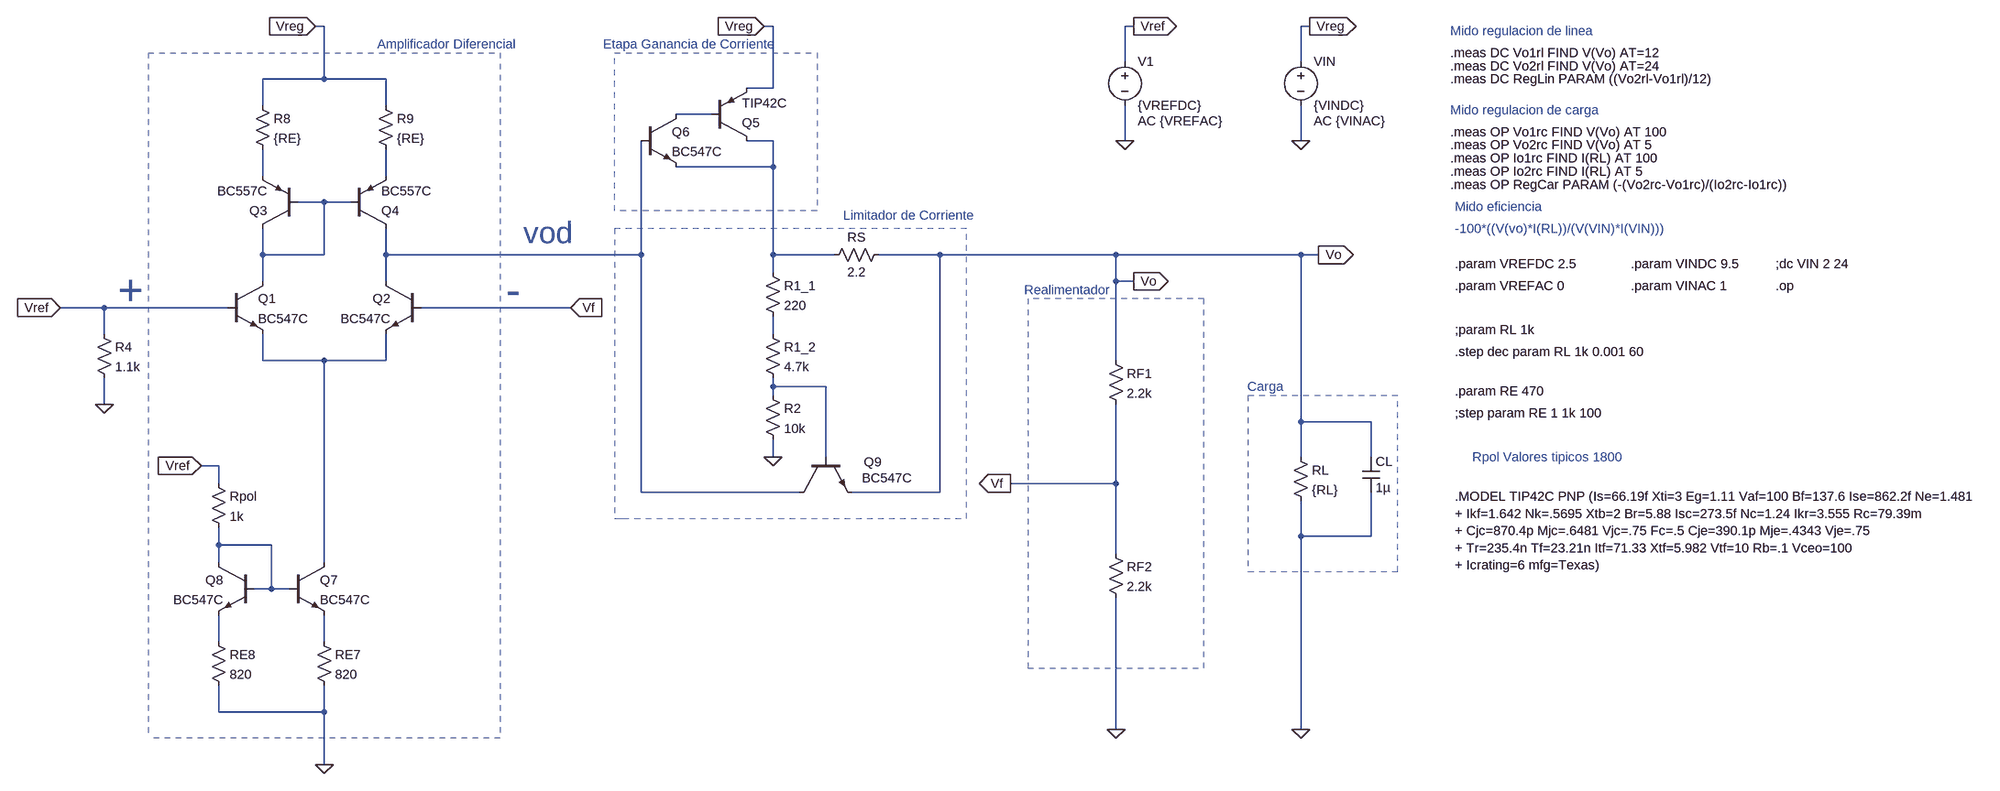
[diagram p0: schematic Regulacion de Carga.asc]
Regulacion de Carga.asc, the LTspice schematic file:
Version 4
SHEET 1 3312 1188
WIRE 208 -224 192 -224
WIRE 1024 -224 1008 -224
WIRE 1680 -224 1664 -224
WIRE 2000 -224 1984 -224
WIRE 1664 -160 1664 -224
WIRE 1984 -160 1984 -224
WIRE 208 -128 208 -224
WIRE 208 -128 96 -128
WIRE 320 -128 208 -128
WIRE 1024 -112 1024 -224
WIRE 1024 -112 976 -112
WIRE 96 -80 96 -128
WIRE 320 -80 320 -128
WIRE 912 -64 848 -64
WIRE 1024 -16 976 -16
WIRE 1664 -16 1664 -80
WIRE 1984 -16 1984 -80
WIRE 1024 32 1024 -16
WIRE 1024 32 848 32
WIRE 96 48 96 0
WIRE 320 48 320 0
WIRE 208 96 160 96
WIRE 256 96 208 96
WIRE 96 192 96 144
WIRE 208 192 208 96
WIRE 208 192 96 192
WIRE 320 192 320 144
WIRE 784 192 784 -16
WIRE 784 192 320 192
WIRE 1024 192 1024 32
WIRE 1136 192 1024 192
WIRE 1328 192 1216 192
WIRE 1648 192 1328 192
WIRE 1984 192 1648 192
WIRE 2016 192 1984 192
WIRE 1024 224 1024 192
WIRE 96 240 96 192
WIRE 320 240 320 192
WIRE 1648 240 1648 192
WIRE 1680 240 1648 240
WIRE -192 288 -272 288
WIRE 32 288 -192 288
WIRE 656 288 384 288
WIRE -192 336 -192 288
WIRE 1024 336 1024 304
WIRE 96 384 96 336
WIRE 208 384 96 384
WIRE 320 384 320 336
WIRE 320 384 208 384
WIRE 1648 384 1648 240
WIRE 1024 432 1024 416
WIRE 1120 432 1024 432
WIRE 1024 448 1024 432
WIRE -192 464 -192 416
WIRE 1984 496 1984 192
WIRE 2112 496 1984 496
WIRE 1024 560 1024 528
WIRE 1120 560 1120 432
WIRE 1984 560 1984 496
WIRE 2112 560 2112 496
WIRE 16 576 -16 576
WIRE 16 608 16 576
WIRE 1648 608 1648 464
WIRE 1648 608 1456 608
WIRE 784 624 784 192
WIRE 1072 624 784 624
WIRE 1328 624 1328 192
WIRE 1328 624 1168 624
WIRE 1984 704 1984 640
WIRE 2112 704 2112 624
WIRE 2112 704 1984 704
WIRE 16 720 16 688
WIRE 112 720 16 720
WIRE 1648 736 1648 608
WIRE 16 752 16 720
WIRE 208 752 208 384
WIRE 112 800 112 720
WIRE 112 800 80 800
WIRE 144 800 112 800
WIRE 16 896 16 848
WIRE 208 896 208 848
WIRE 16 1024 16 976
WIRE 208 1024 208 976
WIRE 208 1024 16 1024
WIRE 1648 1056 1648 816
WIRE 1984 1056 1984 704
WIRE 208 1120 208 1024
FLAG 2016 192 Vo
IOPIN 2016 192 Out
FLAG 1680 -224 Vref
IOPIN 1680 -224 Out
FLAG 1456 608 Vf
IOPIN 1456 608 Out
FLAG 1664 -16 0
FLAG 2000 -224 Vreg
IOPIN 2000 -224 Out
FLAG 1984 1056 0
FLAG 1648 1056 0
FLAG -272 288 Vref
IOPIN -272 288 In
FLAG -16 576 Vref
IOPIN -16 576 In
FLAG 1984 -16 0
FLAG 1008 -224 Vreg
IOPIN 1008 -224 In
FLAG 1024 560 0
FLAG -192 464 0
FLAG 656 288 Vf
IOPIN 656 288 In
FLAG 192 -224 Vreg
IOPIN 192 -224 In
FLAG 208 1120 0
FLAG 1680 240 Vo
IOPIN 1680 240 Out
DATAFLAG 16 288 ""
DATAFLAG 368 192 ""
DATAFLAG 112 192 ""
DATAFLAG 224 96 ""
DATAFLAG 320 32 ""
SYMBOL pnp 160 144 R180
SYMATTR InstName Q3
SYMATTR Value BC557C
SYMBOL pnp 256 144 M180
SYMATTR InstName Q4
SYMATTR Value BC557C
SYMBOL npn 32 240 R0
SYMATTR InstName Q1
SYMATTR Value BC547C
SYMBOL npn 384 240 M0
SYMATTR InstName Q2
SYMATTR Value BC547C
SYMBOL pnp 912 -16 M180
SYMATTR InstName Q5
SYMATTR Value TIP42C
SYMBOL npn 784 -64 R0
SYMATTR InstName Q6
SYMATTR Value BC547C
SYMBOL res 1632 368 R0
SYMATTR InstName RF1
SYMATTR Value 2.2k
SYMBOL res 1632 720 R0
SYMATTR InstName RF2
SYMATTR Value 2.2k
SYMBOL res 1968 544 R0
SYMATTR InstName RL
SYMATTR Value {RL}
SYMBOL voltage 1664 -176 R0
WINDOW 123 24 124 Left 2
WINDOW 39 0 0 Left 0
SYMATTR Value2 AC {VREFAC}
SYMATTR InstName V1
SYMATTR Value {VREFDC}
SYMBOL res 80 -96 R0
SYMATTR InstName R8
SYMATTR Value {RE}
SYMBOL res 304 -96 R0
SYMATTR InstName R9
SYMATTR Value {RE}
SYMBOL cap 2096 560 R0
SYMATTR InstName CL
SYMATTR Value 1µ
SYMBOL voltage 1984 -176 R0
WINDOW 123 24 124 Left 2
WINDOW 39 0 0 Left 0
SYMATTR Value2 AC {VINAC}
SYMATTR InstName VIN
SYMATTR Value {VINDC}
SYMBOL npn 144 752 R0
SYMATTR InstName Q7
SYMATTR Value BC547C
SYMBOL npn 80 752 M0
SYMATTR InstName Q8
SYMATTR Value BC547C
SYMBOL res 0 592 R0
SYMATTR InstName Rpol
SYMATTR Value 1k
SYMBOL npn 1072 560 M90
WINDOW 0 9 117 VRight 2
WINDOW 3 38 114 VRight 2
SYMATTR InstName Q9
SYMATTR Value BC547C
SYMBOL res 1232 176 R90
WINDOW 0 0 56 VBottom 2
WINDOW 3 32 56 VTop 2
SYMATTR InstName RS
SYMATTR Value 2.2
SYMBOL res 1008 432 R0
SYMATTR InstName R2
SYMATTR Value 10k
SYMBOL res 1008 208 R0
SYMATTR InstName R1_1
SYMATTR Value 220
SYMBOL res -208 320 R0
SYMATTR InstName R4
SYMATTR Value 1.1k
SYMBOL res 192 880 R0
SYMATTR InstName RE7
SYMATTR Value 820
SYMBOL res 0 880 R0
SYMATTR InstName RE8
SYMATTR Value 820
SYMBOL res 1008 320 R0
SYMATTR InstName R1_2
SYMATTR Value 4.7k
TEXT 2848 248 Left 2 !.op
TEXT 2584 208 Left 2 !.param VINDC 9.5
TEXT 2584 248 Left 2 !.param VINAC 1
TEXT 2264 208 Left 2 !.param VREFDC 2.5
TEXT 2264 248 Left 2 !.param VREFAC 0
TEXT 2264 328 Left 2 !;param RL 1k
TEXT 2848 208 Left 2 !;dc VIN 2 24
TEXT 2264 480 Left 2 !;step param RE 1 1k 100
TEXT 2264 440 Left 2 !.param RE 470
TEXT 2264 368 Left 2 !.step dec param RL 1k 0.001 60
TEXT 2256 -216 Left 2 ;Mido regulacion de linea
TEXT 2256 -176 Left 2 !.meas DC Vo1rl FIND V(Vo) AT=12
TEXT 2256 -152 Left 2 !.meas DC Vo2rl FIND V(Vo) AT=24
TEXT 2256 -128 Left 2 !.meas DC RegLin PARAM ((Vo2rl-Vo1rl)/12)
TEXT 2256 -72 Left 2 ;Mido regulacion de carga
TEXT 2256 -32 Left 2 !.meas OP Vo1rc FIND V(Vo) AT 100
TEXT 2256 -8 Left 2 !.meas OP Vo2rc FIND V(Vo) AT 5
TEXT 2256 16 Left 2 !.meas OP Io1rc FIND I(RL) AT 100
TEXT 2256 40 Left 2 !.meas OP Io2rc FIND I(RL) AT 5
TEXT 2264 104 Left 2 ;Mido eficiencia
TEXT 2264 144 Left 2 ;-100*((V(vo)*I(RL))/(V(VIN)*I(VIN)))
TEXT 2256 64 Left 2 !.meas OP RegCar PARAM (-(Vo2rc-Vo1rc)/(Io2rc-Io1rc))
TEXT 2296 560 Left 2 ;Rpol Valores tipicos 1800
TEXT 2264 632 Left 2 !.MODEL TIP42C PNP (Is=66.19f Xti=3 Eg=1.11 Vaf=100 Bf=137.6 Ise=862.2f Ne=1.481  \n+ Ikf=1.642 Nk=.5695 Xtb=2 Br=5.88 Isc=273.5f Nc=1.24 Ikr=3.555 Rc=79.39m  \n+ Cjc=870.4p Mjc=.6481 Vjc=.75 Fc=.5 Cje=390.1p Mje=.4343 Vje=.75  \n+ Tr=235.4n Tf=23.21n Itf=71.33 Xtf=5.982 Vtf=10 Rb=.1 Vceo=100  \n+ Icrating=6 mfg=Texas)
TEXT -144 256 Center 6 ;+
TEXT 552 256 Center 6 ;-
TEXT 616 152 Center 5 ;vod
TEXT 304 -192 Left 2 ;Amplificador Diferencial
TEXT 872 -192 Center 2 ;Etapa Ganancia de Corriente
TEXT 1272 120 Center 2 ;Limitador de Corriente
TEXT 1560 256 Center 2 ;Realimentador
TEXT 1920 432 Center 2 ;Carga
LINE Normal 528 1072 -112 1072 1
LINE Normal -112 -176 -112 1072 1
LINE Normal 528 -176 528 1072 1
LINE Normal -112 -176 528 -176 1
LINE Normal 1104 112 736 112 1
LINE Normal 1104 -176 1104 112 1
LINE Normal 736 -176 1104 -176 1
LINE Normal 736 112 736 -176 1
LINE Normal 1376 144 736 144 1
LINE Normal 1376 672 1376 144 1
LINE Normal 752 672 1376 672 1
LINE Normal 736 672 752 672 1
LINE Normal 736 144 736 672 1
LINE Normal 1488 272 1488 592 1
LINE Normal 1488 592 1488 944 1
LINE Normal 1808 272 1488 272 1
LINE Normal 1808 944 1808 272 1
LINE Normal 1488 944 1808 944 1
LINE Normal 2160 448 1888 448 1
LINE Normal 2160 768 2160 448 1
LINE Normal 1888 768 2160 768 1
LINE Normal 1888 448 1888 768 1

The netlist it stands for:
* Regulacion de Carga.asc
Q3 N005 N005 N003 0 BC557C
Q4 N006 N005 N004 0 BC557C
Q1 N005 Vref N008 0 BC547C
Q2 N006 Vf N008 0 BC547C
Q5 N002 N001 Vreg 0 TIP42C
Q6 N001 N006 N002 0 BC547C
RF1 Vo Vf 2.2k
RF2 Vf 0 2.2k
RL Vo 0 {RL}
V1 Vref 0 {VREFDC} AC {VREFAC}
R8 Vreg N003 {RE}
R9 Vreg N004 {RE}
CL Vo 0 1µ
VIN Vreg 0 {VINDC} AC {VINAC}
Q7 N008 N010 N012 0 BC547C
Q8 N010 N010 N011 0 BC547C
Rpol Vref N010 1k
Q9 N006 N009 Vo 0 BC547C
RS Vo N002 2.2
R2 N009 0 10k
R1_1 N002 N007 220
R4 Vref 0 1.1k
RE7 N012 0 820
RE8 N011 0 820
R1_2 N007 N009 4.7k
.model NPN NPN
.model PNP PNP
.lib standard.bjt
.op
.param VINDC 9.5
.param VINAC 1
.param VREFDC 2.5
.param VREFAC 0
;param RL 1k
;dc VIN 2 24
;step param RE 1 1k 100
.param RE 470
.step dec param RL 1k 0.001 60
* Mido regulacion de linea
.meas DC Vo1rl FIND V(Vo) AT=12
.meas DC Vo2rl FIND V(Vo) AT=24
.meas DC RegLin PARAM ((Vo2rl-Vo1rl)/12)
* Mido regulacion de carga
.meas OP Vo1rc FIND V(Vo) AT 100
.meas OP Vo2rc FIND V(Vo) AT 5
.meas OP Io1rc FIND I(RL) AT 100
.meas OP Io2rc FIND I(RL) AT 5
* Mido eficiencia
* -100*((V(vo)*I(RL))/(V(VIN)*I(VIN)))
.meas OP RegCar PARAM (-(Vo2rc-Vo1rc)/(Io2rc-Io1rc))
* Rpol Valores tipicos 1800
.MODEL TIP42C PNP (Is=66.19f Xti=3 Eg=1.11 Vaf=100 Bf=137.6 Ise=862.2f Ne=1.481
+ Ikf=1.642 Nk=.5695 Xtb=2 Br=5.88 Isc=273.5f Nc=1.24 Ikr=3.555 Rc=79.39m
+ Cjc=870.4p Mjc=.6481 Vjc=.75 Fc=.5 Cje=390.1p Mje=.4343 Vje=.75
+ Tr=235.4n Tf=23.21n Itf=71.33 Xtf=5.982 Vtf=10 Rb=.1 Vceo=100
+ Icrating=6 mfg=Texas)
* +
* -
* vod
* Amplificador Diferencial
* Etapa Ganancia de Corriente
* Limitador de Corriente
* Realimentador
* Carga
.backanno
.end

* Results of the author's LTspice run, read from the files saved beside the schematic
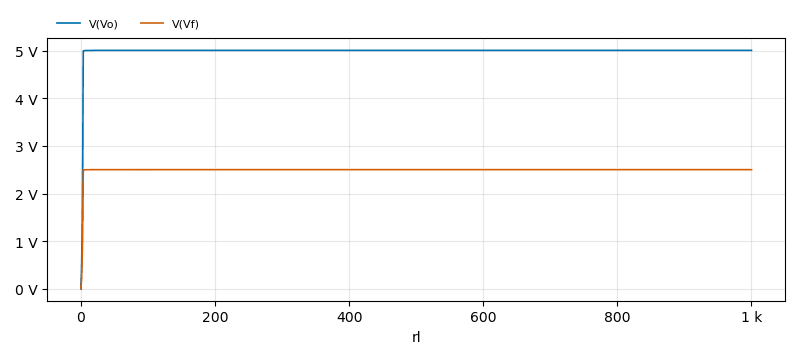
[diagram p1: Operating Point of Regulacion de Carga.asc, plotted from the saved traces]
* Operating Point, 1 run:
*   V(Vo): 428 µV at rl=1 m, 5.006 V at rl=1 k, min 428 µV, max 5.006 V
*   V(Vf): 214 µV at rl=1 m, 2.502 V at rl=1 k, min 214 µV, max 2.502 V
* From the log:
*   Semiconductor Device Operating Points:
*                           --- Bipolar Transistors ---
*   Name:       q5          q9          q8          q7          q6
*   Model:    tip42c      bc547c      bc547c      bc547c      bc547c
*   Ib:      -4.11e-03    2.23e-06    2.27e-06    2.26e-06    8.14e-06
*   Ic:      -4.23e-01    1.03e-03    1.03e-03    1.03e-03    4.11e-03
*   Vbe:     -7.68e-01    6.22e-01    6.23e-01    6.22e-01    6.57e-01
*   Vbc:      7.79e+00   -9.74e-01    0.00e+00   -4.13e-01   -7.14e+00
*   Vce:     -8.56e+00    1.60e+00    6.23e-01    1.04e+00    7.79e+00
*   BetaDC:   1.03e+02    4.61e+02    4.52e+02    4.56e+02    5.05e+02
*   Gm:       1.32e+01    3.90e-02    3.90e-02    3.91e-02    1.53e-01
*   Rpi:      6.51e+00    1.17e+04    1.15e+04    1.16e+04    3.21e+03
*   Rx:       1.00e-01    1.00e+00    1.00e+00    1.00e+00    1.00e+00
*   Ro:       2.55e+02    5.21e+04    5.11e+04    5.15e+04    1.45e+04
*   Cbe:      3.07e-07    5.02e-11    5.03e-11    5.03e-11    1.06e-10
*   Cbc:      1.80e-10    1.67e-12    2.74e-12    2.00e-12    1.00e-12
*   Cjs:      0.00e+00    0.00e+00    0.00e+00    0.00e+00    0.00e+00
*   BetaAC:   8.60e+01    4.58e+02    4.50e+02    4.53e+02    4.93e+02
*   Cbx:      0.00e+00    1.03e-12    1.69e-12    1.23e-12    6.17e-13
*   Ft:       6.83e+06    1.17e+08    1.14e+08    1.16e+08    2.27e+08
*   Name:       q2          q1          q4          q3
*   Model:    bc547c      bc547c      bc557c      bc557c
*   Ib:      -3.51e-12    2.04e-06   -1.81e-06   -2.30e-06
*   Ic:       1.62e-12    1.03e-03   -1.04e-03   -1.02e-03
*   Vbe:     -1.88e+00    6.20e-01   -6.13e-01   -6.19e-01
*   Vbc:     -1.60e+00   -5.90e+00    6.80e+00    0.00e+00
*   Vce:     -2.84e-01    6.52e+00   -7.42e+00   -6.19e-01
*   BetaDC:  -4.63e-01    5.03e+02    5.72e+02    4.44e+02
*   Gm:      -9.12e-39    3.91e-02    3.91e-02    3.84e-02
*   Rpi:      1.00e+12    1.28e+04    1.46e+04    1.15e+04
*   Rx:       1.00e+00    1.00e+00    1.00e+00    1.00e+00
*   Ro:       1.10e+38    5.69e+04    2.94e+04    2.31e+04
*   Cbe:      7.46e-12    5.01e-11    5.21e-11    5.20e-11
*   Cbc:      1.49e-12    1.06e-12    1.54e-12    4.91e-12
*   Cjs:      0.00e+00    0.00e+00    0.00e+00    0.00e+00
*   BetaAC:  -9.12e-27    5.01e+02    5.71e+02    4.41e+02
*   Cbx:      9.13e-13    6.50e-13    9.12e-13    2.90e-12
*   Ft:       1.61e-02    1.20e+08    1.14e+08    1.02e+08
*   vo1rc: v(vo)=5.00534 at 100
*   vo2rc: v(vo)=4.99948 at 5
*   io1rc: i(rl)=0.0500534 at 100
*   io2rc: i(rl)=0.999983 at 5
*   regcar: (-(vo2rc-vo1rc)/(io2rc-io1rc))=0.00617131